# EAGLE design secondaryBoard (EAGLE 7.1.0)
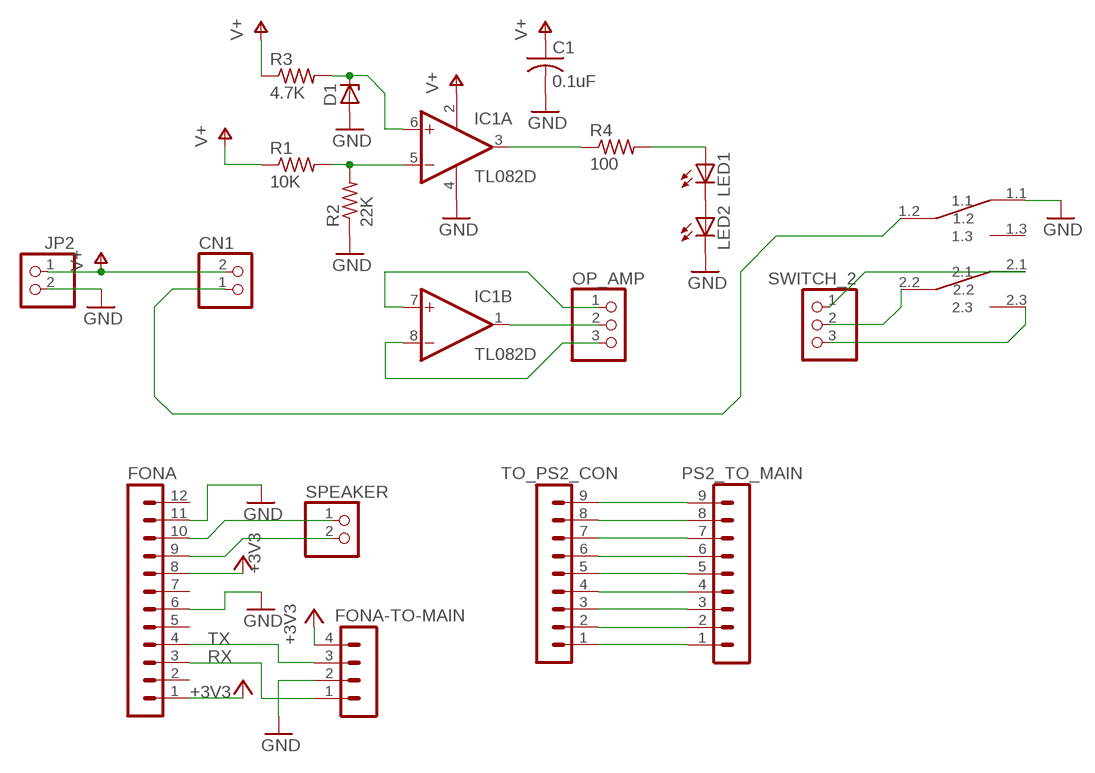
[diagram p0: schematic, sheet 1]

## Parts
C1  0.1uF  C-USC0805  [C0805]
CN1  JST_2PIN-THM  [JST-PH-2-THM]
D1  ZENER-DIODEZD-5  [ZDIO-5]
FONA  MA12-1  [MA12-1]
FONA-TO-MAIN  MA04-1  [MA04-1]
IC1  TL082D  [SO08]
JP2  PINHD-1X2/90  [1X02/90]
LED1  LED5MM  [LED5MM]
LED2  LED5MM  [LED5MM]
OP_AMP  PINHD-1X3CB  [1X03-CLEANBIG]
PS2_TO_MAIN  MA09-1  [MA09-1]
R1  10K  R-US_R0805  [R0805]
R2  22K  R-US_R0805  [R0805]
R3  4.7K  R-US_R0805  [R0805]
R4  100  R-US_R0805  [R0805]
SPEAKER  PINHD-1X2/90  [1X02/90]
SWITCH_2  PINHD-1X3CB  [1X03-CLEANBIG]
TO_PS2_CON  MA09-1  [MA09-1]
U$1  DPDT_8.5A  [DPDT_8.5A]

## Nets
+3V3: FONA-TO-MAIN.4 FONA.1 FONA.8
GND: C1.2 D1.A FONA-TO-MAIN.2 FONA.6 FONA.11 IC1.4(P:V-) JP2.2 LED2.K(C) R2.1 U$1.1.1
N$1: PS2_TO_MAIN.9 TO_PS2_CON.9
N$2: PS2_TO_MAIN.8 TO_PS2_CON.8
N$3: PS2_TO_MAIN.7 TO_PS2_CON.7
N$4: PS2_TO_MAIN.6 TO_PS2_CON.6
N$5: PS2_TO_MAIN.5 TO_PS2_CON.5
N$6: PS2_TO_MAIN.4 TO_PS2_CON.4
N$7: PS2_TO_MAIN.3 TO_PS2_CON.3
N$8: PS2_TO_MAIN.2 TO_PS2_CON.2
N$9: PS2_TO_MAIN.1 TO_PS2_CON.1
N$10: FONA.10 SPEAKER.1
N$11: FONA.9 SPEAKER.2
N$12: CN1.1 U$1.1.2
N$15: R1.2 R2.2
N$16: LED1.K(C) LED2.A
N$17: SWITCH_2.1 U$1.2.1
N$18: SWITCH_2.3 U$1.2.3
N$19: SWITCH_2.2 U$1.2.2
N$20: D1.C IC1.6(A:+IN) R3.2
N$21: IC1.3(A:OUT) R4.1
N$22: LED1.A R4.2
N$23: IC1.7(B:+IN) OP_AMP.1
N$24: IC1.1(B:OUT) OP_AMP.2
N$25: IC1.8(B:-IN) OP_AMP.3
RX: FONA-TO-MAIN.1 FONA.3
TX: FONA-TO-MAIN.3 FONA.4
V+: C1.1 CN1.2 IC1.2(P:V+) JP2.1 R1.1 R3.1
Unconnected: FONA.2 FONA.5 FONA.7 FONA.12 IC1.5(A:-IN) U$1.1.3

## Library data of the parts
C1 = rcl:C-US: CAPACITOR, American symbol
CN1 = adafruit:JST_2PIN: JST 2-Pin Connectors of various flavors SMT-RA (S2B-PH-SM4) 4UConnector #17311 SMT (B2B-PH-SM4) THM-RA (S2B-PH) THM (B2B-PH)
D1 = diode:ZENER-DIODE: Z-Diode
FONA = con-lstb:MA12-1: PIN HEADER; OC_FARNELL: unknown; OC_NEWARK: unknown
FONA-TO-MAIN = con-lstb:MA04-1: PIN HEADER; OC_FARNELL: unknown; OC_NEWARK: unknown
IC1 = TDA2822:TL082: OP AMP Data sheet <http://www.ti.com/lit/ds/symlink/tl084a . pdf>; DATA_SHEET: <a href="http://www.ti.com/lit/ds/symlink/tl084a.pdf"> Data sheet </a>
JP2 SPEAKER = HEADER-1X2-SMD:PINHD-1X2: PIN HEADER
LED1 LED2 = adafruit:LED: LED OSRAM: - CHIPLED LG R971, LG N971, LY N971, LG Q971, LY Q971, LO R971, LY R971 LH N974, LH R974 LS Q976, LO Q976, LY Q976 LO Q996 - Hyper CHIPLED LW Q18S LB Q993, LB Q99A, LB R99A - SideLED LS A670, LO A670, LY A670, LG A670, LP A670 LB A673, LV A673, LT A673, LW A673 LH A674 LY A675 LS A676, LA A676, LO A676, LY A676, LW A676 LS A679, LY A679, LG A679 - Hyper Micro SIDELED® LS Y876, LA Y876, LO Y876, LY Y876 LT Y87S - SmartLED LW L88C, LW L88S LB L89C, LB L89S, LG L890 LS L89K, LO L89K, LY L89K LS L896, LA L896, LO L896, LY L896 - TOPLED LS T670, LO T670, LY T670, LG T670, LP T670 LSG T670, LSP T670, LSY T670, LOP T670, LYG T670 LG T671, LOG T671, LSG T671 LB T673, LV T673, LT T673, LW T673 LH T674 LS T676, LA T676, LO T676, LY T676, LB T676, LH T676, LSB T676, LW T676 LB T67C, LV T67C, LT T67C, LS T67K, LO T67K, LY T67K, LW E67C LS E67B, LA E67B, LO E67B, LY E67B, LB E67C, LV E67C, LT E67C LW T67C LS T679, LY T679, LG T679 LS T770, LO T770, LY T770, LG T770, LP T770 LB T773, LV T773, LT T773, LW T773 LH T774 LS E675, LA E675, LY E675, LS T675 LS T776, LA T776, LO T776, LY T776, LB T776 LHGB T686 LT T68C, LB T68C - Hyper Mini TOPLED® LB M676 - Mini TOPLED Santana® LG M470 LS M47K, LO M47K, LY M47K Source: http://www.osram.convergy.de/
OP_AMP SWITCH_2 = adafruit:PINHD-1X3: PIN HEADER
PS2_TO_MAIN = con-lstb:MA09-1: PIN HEADER; OC_FARNELL: unknown; OC_NEWARK: unknown
R1-R4 = rcl:R-US_: RESISTOR, American symbol
TO_PS2_CON = PS2-CONN:MA09-1: PIN HEADER; OC_FARNELL: unknown; OC_NEWARK: unknown
U$1 = DPDT_8.5A:DPDT_8.5A

## Board
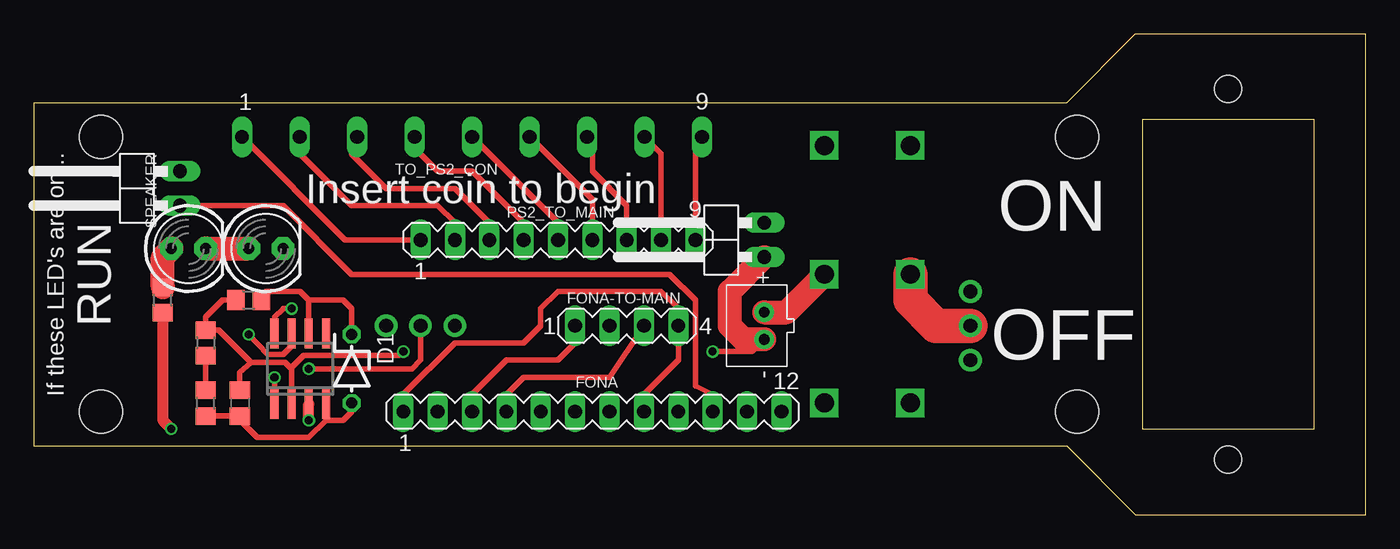
[diagram p1: board, top side]
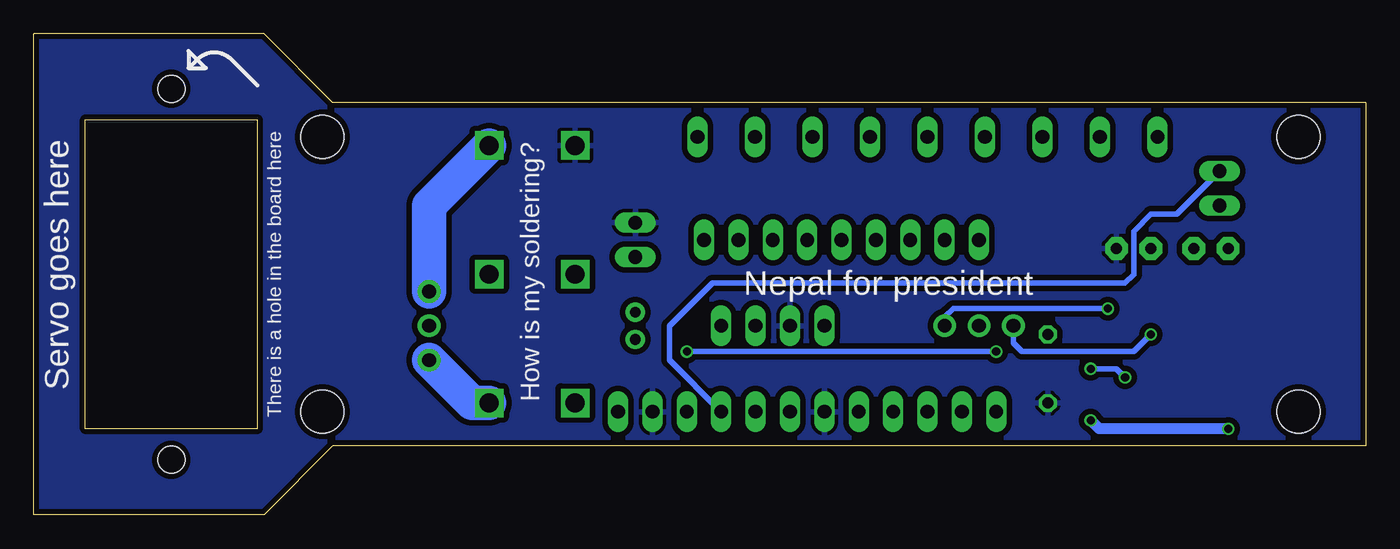
[diagram p2: board, bottom side, seen from below]

Size 98.42 x 35.56 mm. Coordinates in mm from the lower left corner, seen from the top.
Outline: 0,30.48 0,5.08 76.33,5.08 81.41,0 98.42,0 98.42,35.56 81.41,35.56 76.33,30.48 0,30.48
Outline: 94.61,6.35 94.61,29.21 81.92,29.21 81.92,6.35 94.61,6.35
Copper layers (1*16): Top 0.035mm / dielectric 1.5mm / Bottom 0.035mm
Design rules "dirt_cheap_dirty_boards.v1": minimum track width 5mil, minimum drill 12mil, track to track 5mil, track to pad 5mil, pad to pad 5mil, via to via 5mil, smd to smd 0mil, copper to edge 10mil, drill to drill 10mil, minimum pad ring 10mil, minimum via ring 6mil, stop-mask expansion 2mil, vias tented up to drill 25mil, thermal gap 10mil
Holes 2 mm at 88.27,4.06 88.27,31.5
Holes 3.2 mm at 4.95,27.94 4.95,7.62 77.09,7.62 77.09,27.94

### Footprints (pad centres in the part's own frame; a part is rotated, then mirrored left to right if it is on the bottom)
C0805 = smd 1.3 x 1.5: 1 -0.95,0; 2 0.95,0
JST-PH-2-THM = drill 0.8 pad 1.422: 1 1,0; 2 -1,0
ZDIO-5 = drill 0.813 octagon: A 2.54,0; C -2.54,0
MA12-1 = drill 1.016 long: 1 -13.97,0; 2 -11.43,0; 3 -8.89,0; 4 -6.35,0; 5 -3.81,0; 6 -1.27,0; 7 1.27,0; 8 3.81,0; 9 6.35,0; 10 8.89,0; 11 11.43,0; 12 13.97,0
MA04-1 = drill 1.016 long: 1 -3.81,0; 2 -1.27,0; 3 1.27,0; 4 3.81,0
SO08 = smd 0.6 x 2.2: 1 -1.905,-2.6; 2 -0.635,-2.6; 3 0.635,-2.6; 4 1.905,-2.6; 5 1.905,2.6; 6 0.635,2.6; 7 -0.635,2.6; 8 -1.905,2.6
1X02/90 = drill 1.016 long: 1 -1.27,-3.81; 2 1.27,-3.81
LED5MM = drill 0.813 pad 1.676 octagon: A -1.27,0; K 1.27,0
1X03-CLEANBIG = drill 1.016 pad 1.676: 1 -2.54,0; 2 0,0; 3 2.54,0
MA09-1 = drill 1.016 long: 1 -10.16,0; 2 -7.62,0; 3 -5.08,0; 4 -2.54,0; 5 0,0; 6 2.54,0; 7 5.08,0; 8 7.62,0; 9 10.16,0
R0805 = smd 1.3 x 1.5: 1 -0.95,0; 2 0.95,0
MA09-1' = drill 1.016 long: 1 -17,0; 2 -12.75,0; 3 -8.5,0; 4 -4.25,0; 5 0,0; 6 4.25,0; 7 8.5,0; 8 12.75,0; 9 17,0
DPDT_8.5A = drill 1.4 square: 1.1 -9.525,-3.175; 1.2 0,-3.175; 1.3 9.525,-3.175; 2.1 -9.525,3.175; 2.2 0,3.175; 2.3 9.525,3.175

### Placement (x,y rotation side)
C1  15.24,8.26 270 top
CN1  53.98,13.97 90 top
D1  23.5,10.79 270 top
FONA  41.27,7.62 0 top
FONA-TO-MAIN  43.81,13.97 0 top
IC1  19.68,10.79 0 top
JP2  50.16,20.32 90 top
LED1  11.43,19.68 0 top
LED2  17.14,19.68 0 top
OP_AMP  28.57,13.97 0 top
PS2_TO_MAIN  38.73,20.32 0 top
R1  12.7,12.7 270 top
R2  12.7,8.26 90 top
R3  15.88,15.88 0 top
R4  9.53,15.88 90 top
SPEAKER  6.99,24.13 90 top
SWITCH_2  69.22,13.97 270 top
TO_PS2_CON  [MA09-1']  32.38,27.94 0 top
U$1  61.59,17.78 270 top

### Tracks (layer width: path | path; a pad name or v marks a point on that pad's centre or on a via)
+3V3
  Top 0.406: FONA.8 45.09,8.89 47.62,11.43 FONA-TO-MAIN.4 47.62,15.24 46.35,16.51 38.73,16.51 37.47,15.24 37.47,13.97 36.2,12.7 31.11,12.7 27.3,8.89 FONA.1
GND
  Top 0.406: D1.A 23.5,7.62 22.86,6.99 21.59,6.99 | 21.59,6.99 IC1.4 | 21.59,6.99 20.32,5.71 16.51,5.71 15.24,6.99 C1.2 R2.1
  pour Bottom (isolate 0.406): -1.27,3.81 75.56,4.45 80.01,-0.64 99.69,-0.64 99.69,36.2 79.38,36.2 74.93,31.11 -1.27,31.75
N$1
  Top 0.406: PS2_TO_MAIN.9 48.9,27.45 TO_PS2_CON.9
N$2
  Top 0.406: PS2_TO_MAIN.8 46.35,26.72 TO_PS2_CON.8
N$3
  Top 0.406: PS2_TO_MAIN.7 43.81,22.86 41.27,25.4 41.27,27.55 TO_PS2_CON.7
N$4
  Top 0.406: PS2_TO_MAIN.6 41.27,23.3 TO_PS2_CON.6
N$5
  Top 0.406: PS2_TO_MAIN.5 38.73,21.59 TO_PS2_CON.5
N$6
  Top 0.406: PS2_TO_MAIN.4 36.2,21.59 32.38,25.4 29.84,25.4 28.57,26.67 28.57,27.5 TO_PS2_CON.4
N$7
  Top 0.406: PS2_TO_MAIN.3 33.66,21.59 31.11,24.13 26.04,24.13 23.5,26.67 23.5,27.55 TO_PS2_CON.3
N$8
  Top 0.406: PS2_TO_MAIN.2 31.11,21.59 29.84,22.86 23.5,22.86 19.68,26.67 19.68,27.89 TO_PS2_CON.2
N$9
  Top 0.406: PS2_TO_MAIN.1 23,20.32 TO_PS2_CON.1
N$10
  Top 0.406: FONA.10 50.16,8.89 48.9,9.53 48.9,15.88 46.99,17.78 23.5,17.78 18.41,22.86 SPEAKER.1
N$11
  Bottom 0.406: FONA.9 51.44,11.43 51.44,13.97 48.26,17.14 17.78,17.14 17.14,17.78 17.14,20.95 15.88,22.22 13.97,22.22 SPEAKER.2
N$12
  Top 1.778: CN1.1 55.61,14.97 U$1.1.2
N$15
  Top 0.406: R2.2 R1.2
N$16
  Top 1.778: LED1.K LED2.A
N$17
  Bottom 2.54: SWITCH_2.1 69.22,22.86 U$1.2.1
N$18
  Bottom 2.54: SWITCH_2.3 66.04,8.26 U$1.2.3
N$19
  Top 2.54: SWITCH_2.2 66.67,13.97 64.77,15.88 U$1.2.2
N$20
  Top 0.406: D1.C 23.5,15.24 22.86,15.88 20.32,15.88 | 20.32,15.88 IC1.6 | R3.2 16.82,16.19 17.14,16.51 19.68,16.51 20.32,15.88
N$21  (via drill 0.6)
  Top 0.813: R4.1 9.53,6.99 v10.16,6.35 | v20.32,6.99 IC1.3
  Bottom 0.813: v10.16,6.35 19.68,6.35 v20.32,6.99
N$22
  Top 1.778: R4.2 9.53,19.05 LED1.A
N$23  (via drill 0.6)
  Top 0.406: v15.88,13.34 17.28,11.87 18.43,11.87 19.04,12.49 IC1.7
  Bottom 0.406: OP_AMP.1 26.04,12.7 25.4,12.06 17.14,12.06 v15.88,13.34
N$24  (via drill 0.6)
  Top 0.406: IC1.1 v17.78,10.16 | v20.32,10.79 27.94,10.79 28.57,11.43 OP_AMP.2
  Bottom 0.406: v17.78,10.16 18.41,10.79 v20.32,10.79
N$25  (via drill 0.6)
  Top 0.406: v19.05,15.24 18.42,15.24 18.42,15.23 17.78,14.61 IC1.8
  Bottom 0.406: OP_AMP.3 31.11,14.61 30.48,15.24 v19.05,15.24
RX
  Top 0.406: FONA.3 32.38,8.89 34.92,11.43 38.73,11.43 40.01,12.7 FONA-TO-MAIN.1
TX
  Top 0.406: FONA.4 34.92,8.89 36.2,10.16 42.55,10.16 FONA-TO-MAIN.3
V+  (via drill 0.6)
  Top 0.406: C1.1 15.23,10.53 16.05,11.26 | 16.05,11.26 18.59,11.26 19.05,10.79 | 19.05,10.79 IC1.2 | 16.05,11.26 13.65,13.65 R1.1 12.7,14.61 13.97,15.88 R3.1 | 19.05,10.79 19.05,10.88 19.93,11.77 27.01,11.77 v27.3,12.06 | v50.16,12.06 53.07,12.06 CN1.2
  Top 1.778: CN1.2 52.44,12.97 51.44,13.97 51.44,16.51 JP2.1
  Bottom 0.406: v27.3,12.06 v50.16,12.06

### Text on the board
tNames: Insert coin to begin | ON | If these LED's are on... | RUN | OFF
bNames: How is my soldering? | Servo goes here | Nepal for president | There is a hole in the board here